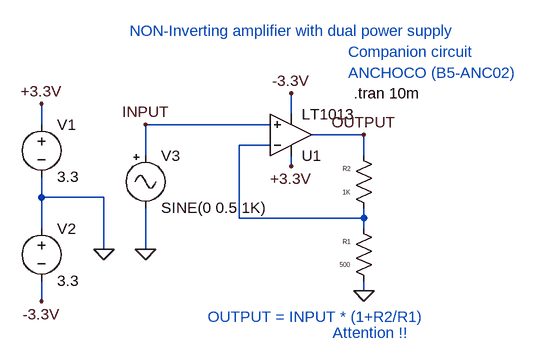
[diagram p0: schematic non_inverting_amp_dual_pow.asc]
non_inverting_amp_dual_pow.asc, the LTspice schematic file:
Version 4
SHEET 1 948 680
WIRE -48 32 -48 0
WIRE -432 48 -432 16
WIRE -80 48 -272 48
WIRE 64 64 -16 64
WIRE -80 80 -128 80
WIRE -272 96 -272 48
WIRE 64 96 64 64
WIRE -48 112 -48 96
WIRE -432 160 -432 128
WIRE -336 160 -432 160
WIRE -128 192 -128 80
WIRE 64 192 64 176
WIRE 64 192 -128 192
WIRE -432 208 -432 160
WIRE 64 208 64 192
WIRE -336 240 -336 160
WIRE -272 240 -272 176
WIRE 64 304 64 288
WIRE -432 320 -432 288
FLAG -336 240 0
FLAG -432 16 +3.3V
FLAG -432 320 -3.3V
FLAG -48 112 +3.3V
FLAG -48 0 -3.3V
FLAG -272 240 0
FLAG -272 48 INPUT
FLAG 64 64 OUTPUT
FLAG 64 304 0
SYMBOL voltage -432 32 R0
WINDOW 123 0 0 Left 0
WINDOW 39 0 0 Left 0
SYMATTR InstName V1
SYMATTR Value 3.3
SYMBOL voltage -432 192 R0
WINDOW 123 0 0 Left 0
WINDOW 39 0 0 Left 0
SYMATTR InstName V2
SYMATTR Value 3.3
SYMBOL res 80 304 R180
WINDOW 0 36 76 Left 0
WINDOW 3 36 40 Left 0
SYMATTR InstName R1
SYMATTR Value 500
SYMBOL res 80 192 R180
WINDOW 0 36 76 Left 0
WINDOW 3 36 40 Left 0
SYMATTR InstName R2
SYMATTR Value 1K
SYMBOL Misc\\signal -272 80 R0
WINDOW 123 0 0 Left 0
WINDOW 39 0 0 Left 0
SYMATTR InstName V3
SYMATTR Value SINE(0 0.5 1K)
SYMBOL Opamps\\LT1013 -48 128 M180
SYMATTR InstName U1
TEXT 48 0 Left 2 !.tran 10m
TEXT -296 -96 Left 2 ;NON-Inverting amplifier with dual power supply
TEXT 40 -32 Left 2 ;ANCHOCO (B5-ANC02)
TEXT 40 -64 Left 2 ;Companion circuit
TEXT -176 344 Left 2 ;OUTPUT = INPUT * (1+R2/R1)
TEXT 16 368 Left 2 ;Attention !!

The netlist it stands for:
* non_inverting_amp_dual_pow.asc
V1 +3.3V 0 3.3
V2 0 -3.3V 3.3
R1 0 N001 500
R2 N001 OUTPUT 1K
V3 INPUT 0 SINE(0 0.5 1K)
XU1 INPUT N001 +3.3V -3.3V OUTPUT LT1013  ; pins In+ In- V+ V- OUT
.tran 10m
* NON-Inverting amplifier with dual power supply
* ANCHOCO (B5-ANC02)
* Companion circuit
* OUTPUT = INPUT * (1+R2/R1)
* Attention !!
.lib LTC.lib
.backanno
.end